# Altium schematic sheet STMF4VE.SchDoc
size A2
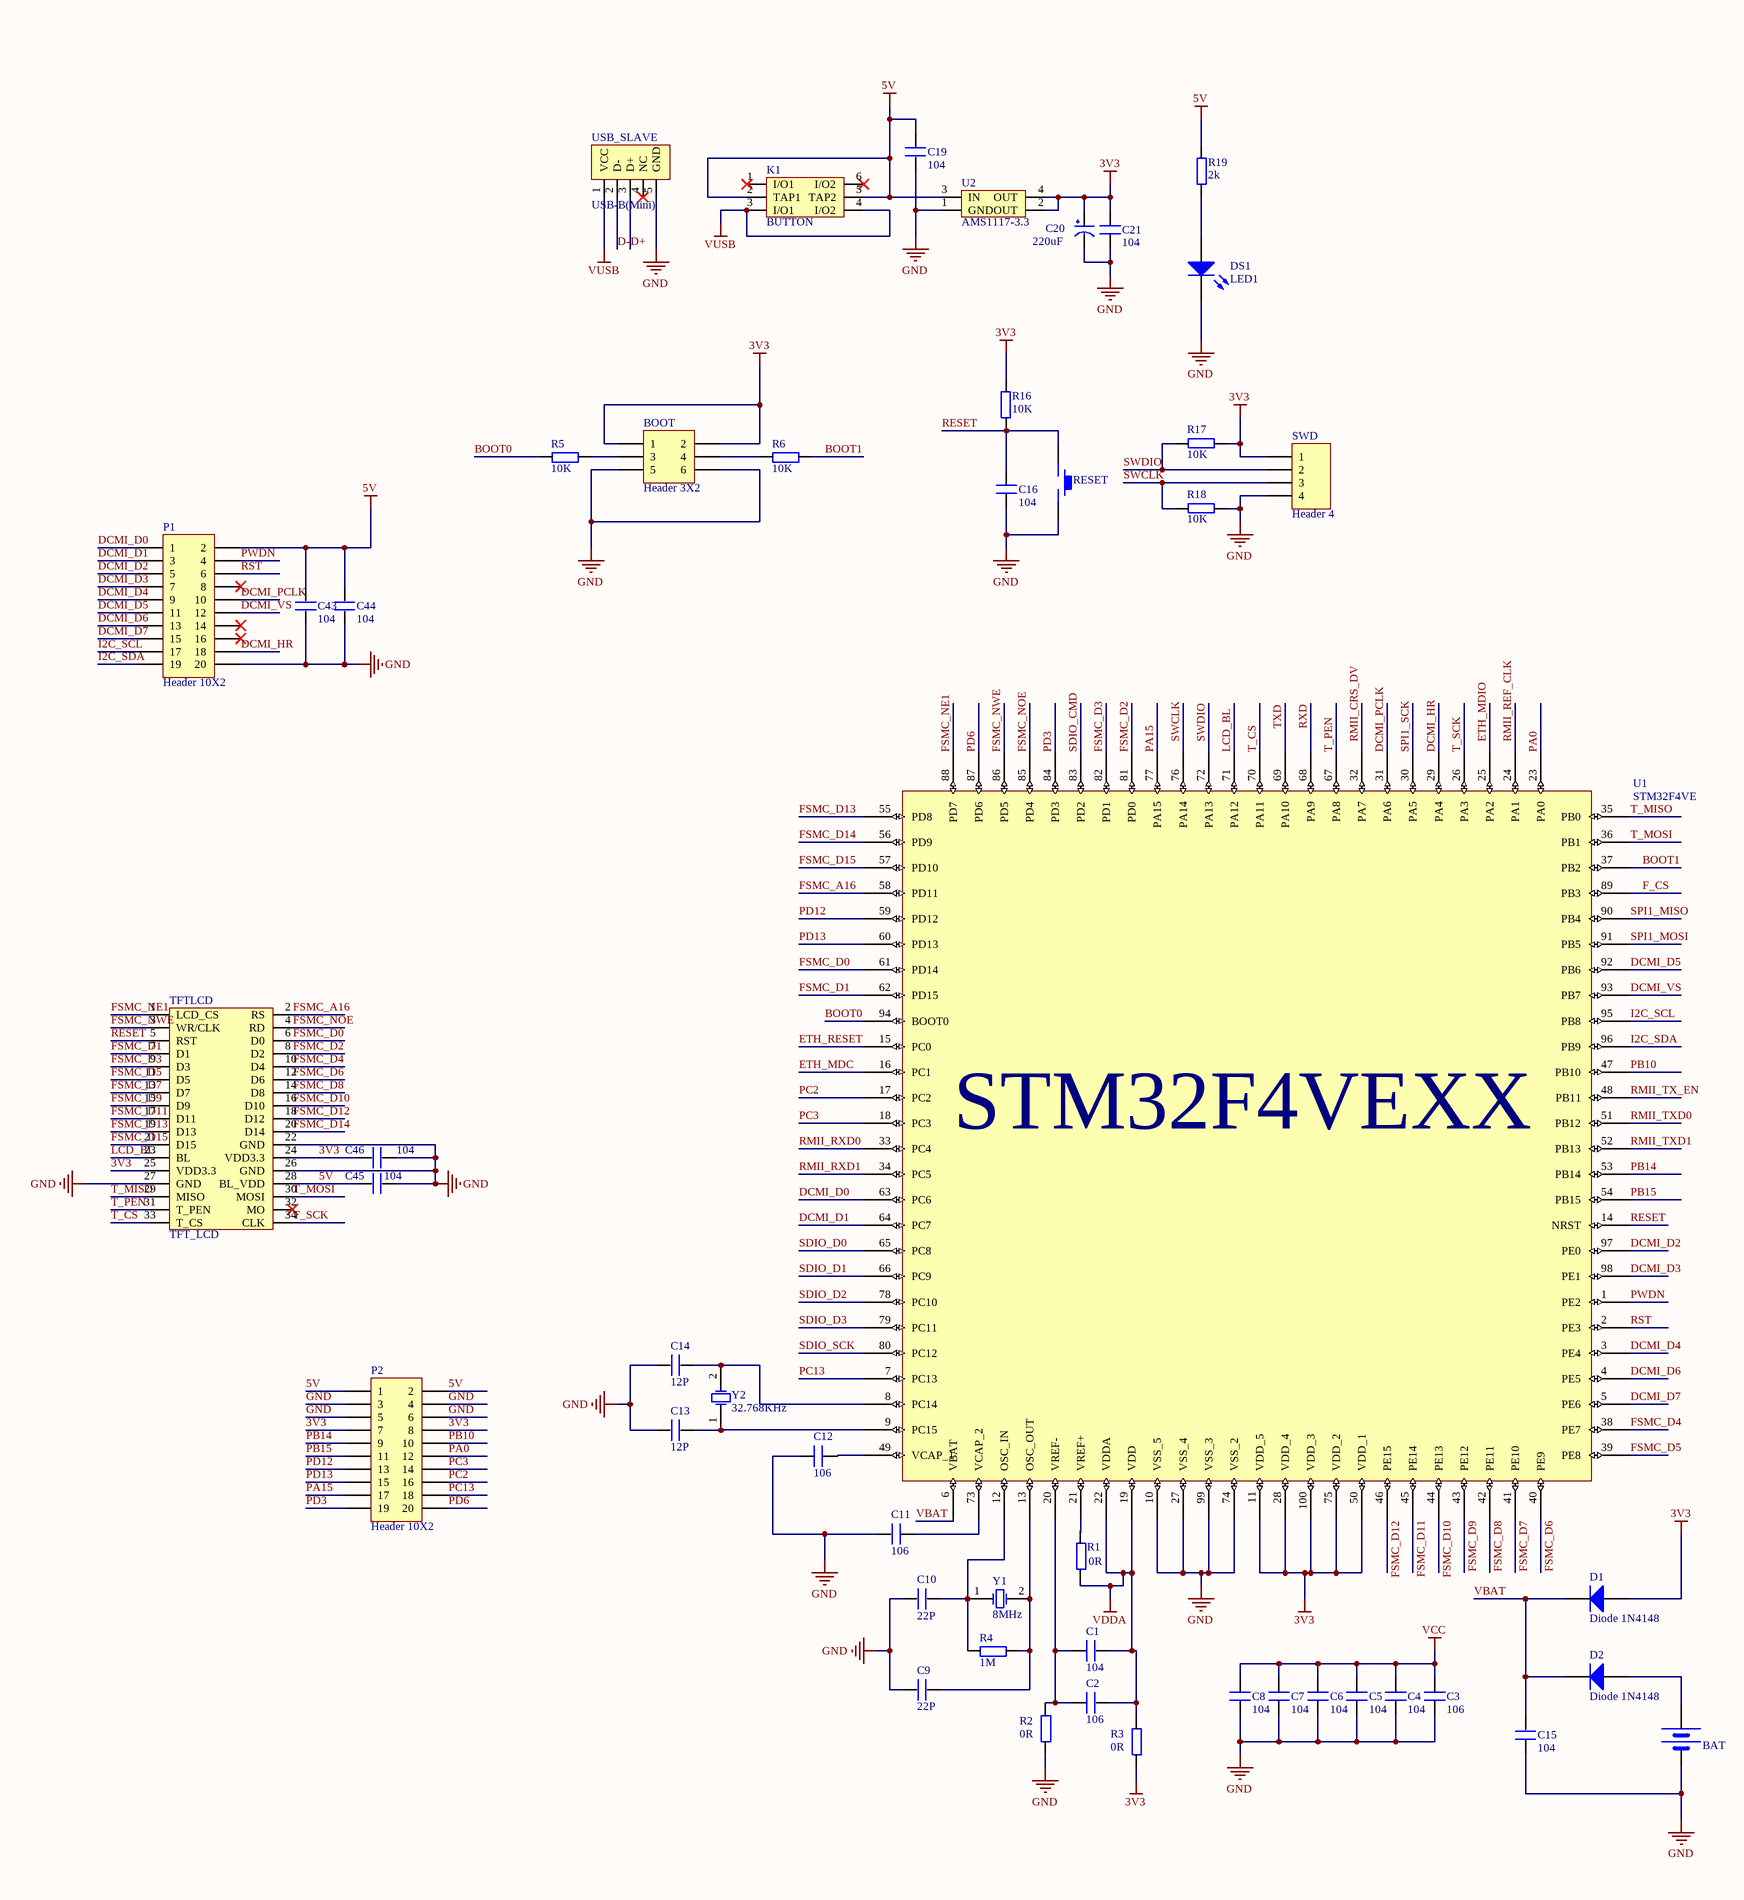
[diagram p0: STMF4VE.SchDoc, left]
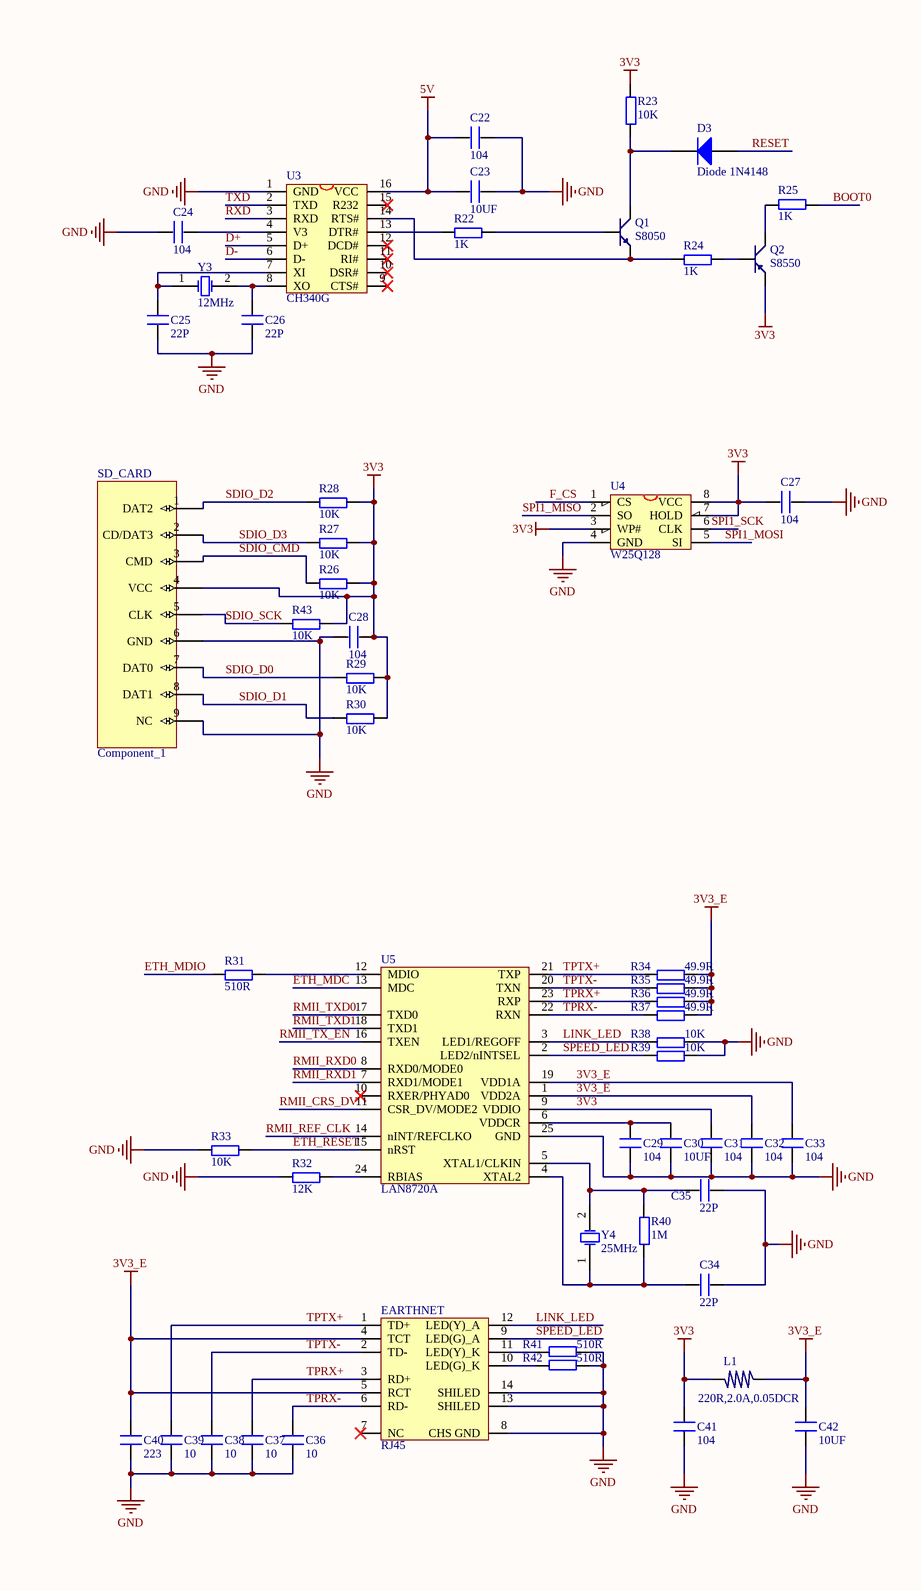
[diagram p1: STMF4VE.SchDoc, right]

## Parts
BAT  BATT  [BATM]  (value not drawn)
BOOT  Header 3X2  [HDR2X3]
C1  104  [0603P]
C2  106  [0805]
C3  106  [0805]
C4  104  [0603P]
C5  104  [0603P]
C6  104  [0603P]
C7  104  [0603P]
C8  104  [0603P]
C9  22P  [0603P]
C10  22P  [0603P]
C11  106  [0603P]
C12  106  [0603P]
C13  12P  [0603P]
C14  12P  [0603P]
C15  104  [0603P]
C16  104  [0603P]
C19  104  [0603P]
C20  220uF  [CC6.56.5]
C21  104  [0603P]
C22  104  [0603P]
C23  10UF  [0603P]
C24  104  [0603P]
C25  22P  [0603P]
C26  22P  [0603P]
C27  104  [0603P]
C28  104  [0603P]
C29  104  [0603P]
C30  10UF  [0603P]
C31  104  [0603P]
C32  104  [0603P]
C33  104  [0603P]
C34  22P  [0603P]
C35  22P  [0603P]
C36  10  [0603P]
C37  10  [0603P]
C38  10  [0603P]
C39  10  [0603P]
C40  223  [0603P]
C41  104  [0603P]
C42  10UF  [0603P]
C43  104  [0603P]
C44  104  [0603P]
C45  104  [0603P]
C46  104  [0603P]
D1  Diode 1N4148  [DO-35]
D2  Diode 1N4148  [DO-35]
D3  Diode 1N4148  [DO-35]
DS1  LED1  [SMDLED]
EARTHNET  RJ45  [HR911105A]
K1  BUTTON  [BTN8.5*8.5]
L1  220R,2.0A,0.05DCR  [0603P]
P1  Header 10X2  [HDR2X10]
P2  Header 10X2  [HDR2X10]
Q1  S8050  [SOT-23R]
Q2  S8550  [SOT-23R]
R1  0R  [0603P]
R2  0R  [0603P]
R3  0R  [0603P]
R4  1M  [0603P]
R5  10K  [0603P]
R6  10K  [0603P]
R16  10K  [0603P]
R17  10K  [0603P]
R18  10K  [0603P]
R19  2k  [0603P]
R22  1K  [0603P]
R23  10K  [0603P]
R24  1K  [0603P]
R25  1K  [0603P]
R26  10K  [0603P]
R27  10K  [0603P]
R28  10K  [0603P]
R29  10K  [0603P]
R30  10K  [0603P]
R31  510R  [0603P]
R32  12K  [0603P]
R33  10K  [0603P]
R34  49.9R  [0603P]
R35  49.9R  [0603P]
R36  49.9R  [0603P]
R37  49.9R  [0603P]
R38  10K  [0603P]
R39  10K  [0603P]
R40  1M  [0603P]
R41  510R  [0603P]
R42  510R  [0603P]
R43  10K  [0603P]
RESET  KEY_M  [KEY_M]  (value not drawn)
SD_CARD  Component_1  [TF_SD]
SWD  Header 4  [HDR1X4]
TFTLCD  TFT_LCD  [TFT_LCD]
U1  STM32F4VE  [LQFP100]
U2  AMS1117-3.3  [AMS1117]
U3  CH340G  [SOP16M]
U4  W25Q128  [SOIC-8]
U5  LAN8720A  [QFN24]
USB_SLAVE  USB-B(Mini)  [USB/SM0.8-6H5]
Y1  8MHz  [49S_SMD]
Y2  32.768KHz  [JZ32768]
Y3  12MHz  [49S_SMD]
Y4  25MHz  [49S_SMD]

## Nets
3V3: BOOT.1 BOOT.2 C20.1(VCC) C21.2 C27.1 C28.2 C31.2 C41.2 C46.1 D1.1(A) L1.2 P2.7 P2.8 Q2.1(E) R3.1 R16.1 R17.1 R23.2 R26.2 R27.2 R28.2 R29.2 R30.2 R43.2 SD_CARD.4(VCC) SWD.1 TFTLCD.24(VDD3.3) TFTLCD.25(VDD3.3) U1.11(VDD_5) U1.28(VDD_4) U1.50(VDD_1) U1.75(VDD_2) U1.100(VDD_3) U2.2(OUT) U2.4(OUT) U4.3(WP#) U4.7(HOLD) U4.8(VCC) U5.9(VDDIO)
3V3_E: C32.2 C33.2 C40.2 C42.2 EARTHNET.4(TCT) EARTHNET.5(RCT) L1.1 R34.2 R35.2 R36.2 R37.2 U5.1(VDD2A) U5.19(VDD1A)
5V: C19.1 C22.2 C23.1 C43.2 C44.2 C45.1 K1.2(TAP1) K1.5(TAP2) P1.2 P2.1 P2.2 R19.2 TFTLCD.28(BL_VDD) U2.3(IN) U3.16(VCC)
GND: BAT.2(GND) BOOT.5 BOOT.6 C3.1 C4.1 C5.1 C6.1 C7.1 C8.1 C9.2 C10.2 C11.1 C12.1 C13.1 C14.1 C15.1 C16.1 C19.2 C20.2(GND) C21.1 C22.1 C23.2 C24.1 C25.1 C26.1 C27.2 C28.1 C29.1 C30.1 C31.1 C32.1 C33.1 C34.2 C35.2 C36.1 C37.1 C38.1 C39.1 C40.1 C41.1 C42.1 C43.1 C44.1 C45.2 C46.2 DS1.2(K) EARTHNET.8(CHS_GND) EARTHNET.13(SHILED) EARTHNET.14(SHILED) P1.20 P2.3 P2.4 P2.5 P2.6 R2.1 R18.1 R32.1 R33.1 R38.2 R39.2 R41.1 R42.1 RESET.2 SD_CARD.6(GND) SD_CARD.9(NC) SWD.4 TFTLCD.22(GND) TFTLCD.26(GND) TFTLCD.27(GND) U1.10(VSS_5) U1.27(VSS_4) U1.74(VSS_2) U1.99(VSS_3) U2.1(GND) U3.1(GND) U4.4(GND) U5.25(GND) USB_SLAVE.5(GND)
VCC: C3.2 C4.2 C5.2 C6.2 C7.2 C8.2
VDDA: C1.2 C2.2 R1.1 R3.2 U1.19(VDD) U1.22(VDDA)
VUSB: K1.3(I/O1) K1.4(I/O2) USB_SLAVE.1(VCC)
BOOT0: R5.1 R25.1 U1.94(BOOT0)
BOOT1: R6.2 U1.37(PB2)
D+: U3.5(D+) USB_SLAVE.3(D+)
D-: U3.6(D-) USB_SLAVE.2(D-)
DCMI_D0: P1.1 U1.63(PC6)
DCMI_D1: P1.3 U1.64(PC7)
DCMI_D2: P1.5 U1.97(PE0)
DCMI_D3: P1.7 U1.98(PE1)
DCMI_D4: P1.9 U1.3(PE4)
DCMI_D5: P1.11 U1.92(PB6)
DCMI_D6: P1.13 U1.4(PE5)
DCMI_D7: P1.15 U1.5(PE6)
DCMI_HR: P1.18 U1.29(PA4)
DCMI_PCLK: P1.10 U1.31(PA6)
DCMI_VS: P1.12 U1.93(PB7)
ETH_MDC: U1.16(PC1) U5.13(MDC)
ETH_MDIO: R31.1 U1.25(PA2)
ETH_RESET: R33.2 U1.15(PC0) U5.15(nRST)
F_CS: U1.89(PB3) U4.1(CS)
FSMC_A16: TFTLCD.2(RS) U1.58(PD11)
FSMC_D0: TFTLCD.6(D0) U1.61(PD14)
FSMC_D1: TFTLCD.7(D1) U1.62(PD15)
FSMC_D2: TFTLCD.8(D2) U1.81(PD0)
FSMC_D3: TFTLCD.9(D3) U1.82(PD1)
FSMC_D4: TFTLCD.10(D4) U1.38(PE7)
FSMC_D5: TFTLCD.11(D5) U1.39(PE8)
FSMC_D6: TFTLCD.12(D6) U1.40(PE9)
FSMC_D7: TFTLCD.13(D7) U1.41(PE10)
FSMC_D8: TFTLCD.14(D8) U1.42(PE11)
FSMC_D9: TFTLCD.15(D9) U1.43(PE12)
FSMC_D10: TFTLCD.16(D10) U1.44(PE13)
FSMC_D11: TFTLCD.17(D11) U1.45(PE14)
FSMC_D12: TFTLCD.18(D12) U1.46(PE15)
FSMC_D13: TFTLCD.19(D13) U1.55(PD8)
FSMC_D14: TFTLCD.20(D14) U1.56(PD9)
FSMC_D15: TFTLCD.21(D15) U1.57(PD10)
FSMC_NE1: TFTLCD.1(LCD_CS) U1.88(PD7)
FSMC_NOE: TFTLCD.4(RD) U1.85(PD4)
FSMC_NWE: TFTLCD.3(WR/CLK) U1.86(PD5)
I2C_SCL: P1.17 U1.95(PB8)
I2C_SDA: P1.19 U1.96(PB9)
LCD_BL: TFTLCD.23(BL) U1.71(PA12)
LINK_LED: EARTHNET.12(LED(Y)_A) R38.1 U5.3(LED1/REGOFF)
PA0: P2.12 U1.23(PA0)
PA15: P2.17 U1.77(PA15)
PB10: P2.10 U1.47(PB10)
PB14: P2.9 U1.53(PB14)
PB15: P2.11 U1.54(PB15)
PC2: P2.16 U1.17(PC2)
PC3: P2.14 U1.18(PC3)
PC13: P2.18 U1.7(PC13)
PD3: P2.19 U1.84(PD3)
PD6: P2.20 U1.87(PD6)
PD12: P2.13 U1.59(PD12)
PD13: P2.15 U1.60(PD13)
PWDN: P1.4 U1.1(PE2)
RESET: C16.2 D3.1(A) R16.2 RESET.1 TFTLCD.5(RST) U1.14(NRST)
RMII_CRS_DV: U1.32(PA7) U5.11(CSR_DV/MODE2)
RMII_REF_CLK: U1.24(PA1) U5.14(nINT/REFCLKO)
RMII_RXD0: U1.33(PC4) U5.8(RXD0/MODE0)
RMII_RXD1: U1.34(PC5) U5.7(RXD1/MODE1)
RMII_TX_EN: U1.48(PB11) U5.16(TXEN)
RMII_TXD0: U1.51(PB12) U5.17(TXD0)
RMII_TXD1: U1.52(PB13) U5.18(TXD1)
RST: P1.6 U1.2(PE3)
RXD: U1.68(PA9) U3.3(RXD)
SDIO_CMD: R26.1 SD_CARD.3(CMD) U1.83(PD2)
SDIO_D0: R29.1 SD_CARD.7(DAT0) U1.65(PC8)
SDIO_D1: R30.1 SD_CARD.8(DAT1) U1.66(PC9)
SDIO_D2: R28.1 SD_CARD.1(DAT2) U1.78(PC10)
SDIO_D3: R27.1 SD_CARD.2(CD/DAT3) U1.79(PC11)
SDIO_SCK: R43.1 SD_CARD.5(CLK) U1.80(PC12)
SPEED_LED: EARTHNET.9(LED(G)_A) R39.1 U5.2(LED2/nINTSEL)
SPI1_MISO: U1.90(PB4) U4.2(SO)
SPI1_MOSI: U1.91(PB5) U4.5(SI)
SPI1_SCK: U1.30(PA5) U4.6(CLK)
SWCLK: R18.2 SWD.3 U1.76(PA14)
SWDIO: R17.2 SWD.2 U1.72(PA13)
T_CS: TFTLCD.33(T_CS) U1.70(PA11)
T_MISO: TFTLCD.29(MISO) U1.35(PB0)
T_MOSI: TFTLCD.30(MOSI) U1.36(PB1)
T_PEN: TFTLCD.31(T_PEN) U1.67(PA8)
T_SCK: TFTLCD.34(CLK) U1.26(PA3)
TPRX+: C37.2 EARTHNET.3(RD+) R36.1 U5.23(RXP)
TPRX-: C36.2 EARTHNET.6(RD-) R37.1 U5.22(RXN)
TPTX+: C39.2 EARTHNET.1(TD+) R34.1 U5.21(TXP)
TPTX-: C38.2 EARTHNET.2(TD-) R35.1 U5.20(TXN)
TXD: U1.69(PA10) U3.2(TXD)
VBAT: C15.2 D1.2(K) D2.2(K) U1.6(VBAT)
NetBAT_1: BAT.1(VCC) D2.1(A)
NetBOOT_3: BOOT.3 R5.2
NetBOOT_4: BOOT.4 R6.1
NetC1_1: C1.1 C2.1 R2.2 U1.20(VREF-)
NetC9_1: C9.1 R4.2 U1.13(OSC_OUT) Y1.2(OSC2)
NetC10_1: C10.1 R4.1 U1.12(OSC_IN) Y1.1(OSC1)
NetC11_2: C11.2 U1.73(VCAP_2)
NetC12_2: C12.2 U1.49(VCAP_1)
NetC13_2: C13.2 U1.9(PC15) Y2.1(OSC1)
NetC14_2: C14.2 U1.8(PC14) Y2.2(OSC2)
NetC24_2: C24.2 U3.4(V3)
NetC25_2: C25.2 U3.7(XI) Y3.1(OSC1)
NetC26_2: C26.2 U3.8(XO) Y3.2(OSC2)
NetC29_2: C29.2 C30.2 U5.6(VDDCR)
NetC34_1: C34.1 R40.1 U5.4(XTAL2) Y4.1(OSC1)
NetC35_1: C35.1 R40.2 U5.5(XTAL1/CLKIN) Y4.2(OSC2)
NetD3_2: D3.2(K) Q1.3(C) R23.1
NetDS1_1: DS1.1(A) R19.1
NetEARTHNET_10: EARTHNET.10(LED(G)_K) R42.2
NetEARTHNET_11: EARTHNET.11(LED(Y)_K) R41.2
NetQ1_1: Q1.1(E) R24.1 U3.14(RTS#)
NetQ1_2: Q1.2(B) R22.2
NetQ2_2: Q2.2(B) R24.2
NetQ2_3: Q2.3(C) R25.2
NetR1_2: R1.2 U1.21(VREF+)
NetR22_1: R22.1 U3.13(DTR#)
NetR31_2: R31.2 U5.12(MDIO)
NetR32_2: R32.2 U5.24(RBIAS)

Not connected (* = marked no-connect by the designer): EARTHNET 7(NC)*; K1 1(I/O1)* 6(I/O2)*; P1 8* 14* 16*; TFTLCD 32(MO)*; U3 9(CTS#)* 10(DSR#)* 11(RI#)* 12(DCD#)* 15(R232)*; U5 10(RXER/PHYAD0)*; USB_SLAVE 4(NC)*

## Notes on the sheet
- (in symbol STM32F4VE) STM32F4VEXX

## Library data of the parts
BAT = BAT
BOOT = Header 3X2: Header, 3-Pin, Dual row; LatestRevisionDate: 17-Jul-2002; LatestRevisionNote: Re-released for DXP Platform.; Publisher: Altium Limited
C1-C16 C19 C21-C46 = C
C20 = CAP
D1-D3 = Diode 1N4148: High Conductance Fast Diode; Published: 8-Jun-2000; LatestRevisionDate: 17-Jul-2002; LatestRevisionNote: Re-released for DXP Platform.; DatasheetVersion: 1997; PackageReference: DO-35; Publisher: Altium Limited; PackageDescription: Diode, Axial; Body 3.8 x 1.9 mm (LxDia. max), Lead Dia. 0.53 mm (max); Code_JEDEC: DO-204-AH; ComponentLink1Description: Manufacturer Link; ComponentLink1URL: http://www.fairchildsemi.com/; ComponentLink2Description: Datasheet; ComponentLink2URL: http://www.fairchildsemi.com/ds/1N%2F1N4148.pdf
DS1 = LED2: Typical RED, GREEN, YELLOW, AMBER GaAs LED; Published: 8-Jun-2000; LatestRevisionDate: 17-Jul-2002; LatestRevisionNote: Re-released for DXP Platform.; PackageDocument: Feb-2002; PackageReference: 3.2X1.6X1.1; Publisher: Altium Limited
EARTHNET = HR911105
L1 = L
P1 P2 = Header 10X2: Header, 10-Pin, Dual row; LatestRevisionDate: 17-Jul-2002; LatestRevisionNote: Re-released for DXP Platform.; Publisher: Altium Limited
Q1 = NPN: 8050/BCW846/BCW847
Q2 = PNP: 8550/BCW68
R1-R6 R16-R19 R22-R43 = R
SWD = Header 4: Header, 4-Pin; LatestRevisionDate: 17-Jul-2002; LatestRevisionNote: Re-released for DXP Platform.; Publisher: Altium Limited
U2 = AMS1117
U3 = CH340G: USB2UART
U4 = W25X16: W25X16;SST25VF016;MX25L1605
U5 = LAN8720: ETH PHY
USB_SLAVE = USB5
Y1-Y4 = XTAL: Crystal Oscillator; Published: 8-Jun-2000; LatestRevisionDate: 17-Jul-2002; LatestRevisionNote: Re-released for DXP Platform.; Publisher: Altium Limited